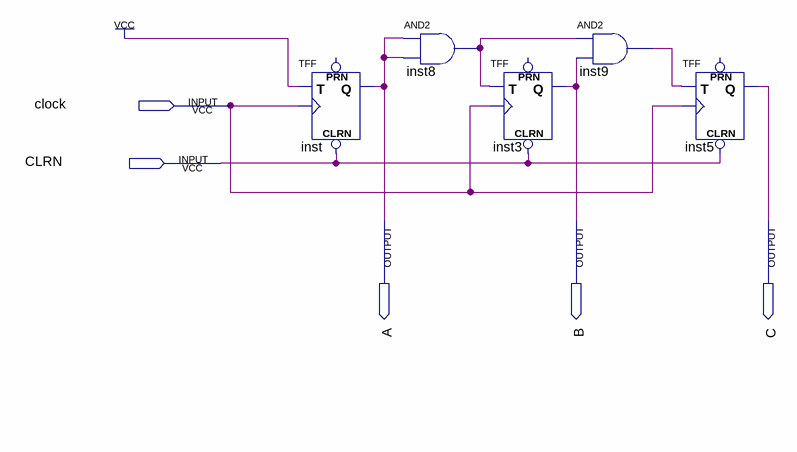
[diagram p0: schematic sheet]
// Quartus schematic Contador2.bdf as structural Verilog: 5 symbols, 5 pins
module Contador2 (
  input  clock,
  input  CLRN,
  output A,
  output B,
  output C
);

  wire inst8_out, inst9_out;

  TFF inst (.CLRN(CLRN), .T(1'b1), .CLK(clock), .Q(A));  // open: PRN
  and inst8 (inst8_out, A, A);
  TFF inst3 (.CLRN(CLRN), .T(inst8_out), .CLK(clock), .Q(B));  // open: PRN
  and inst9 (inst9_out, inst8_out, B);
  TFF inst5 (.CLRN(CLRN), .T(inst9_out), .CLK(clock), .Q(C));  // open: PRN
endmodule
